# EAGLE design vest-ctrl (EAGLE 6.5.0)
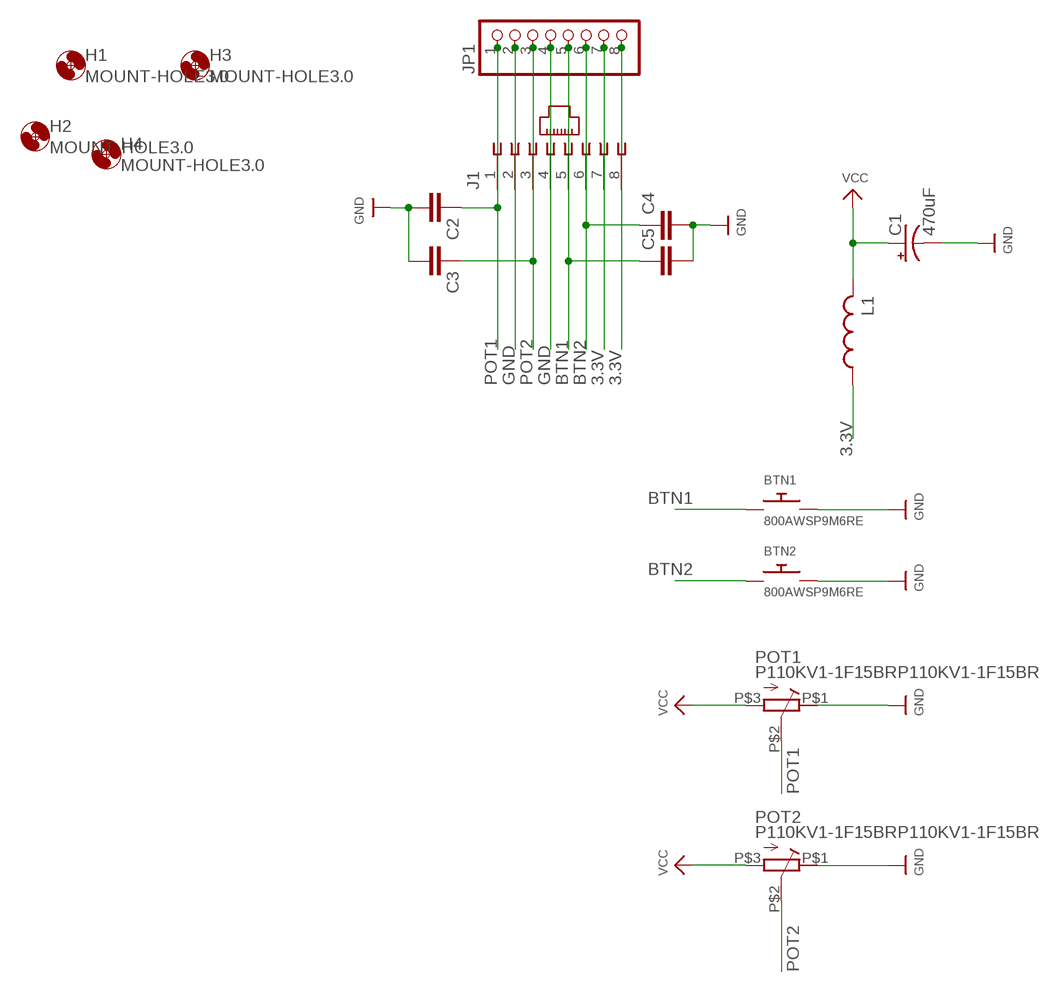
[diagram p0: schematic, sheet 1]

## Parts
BTN1  800AWSP9M6RE  [800AWSP9M6RE]
BTN2  800AWSP9M6RE  [800AWSP9M6RE]
C1  470uF  CPOL-USTT2D5L  [TT2D5L]
C2  C-EU025-025X050  [C025-025X050]
C3  C-EU025-025X050  [C025-025X050]
C4  C-EU025-025X050  [C025-025X050]
C5  C-EU025-025X050  [C025-025X050]
H1  MOUNT-HOLE3.0  [3,0]
H2  MOUNT-HOLE3.0  [3,0]
H3  MOUNT-HOLE3.0  [3,0]
H4  MOUNT-HOLE3.0  [3,0]
J1  215877-4  [215877-4]
JP1  HEADER-1X870MIL  [1X08_ROUND_70]
L1  L-US0207/10  [0207/10]
POT1  P110KV1-1F15BRP110KV1-1F15BR  [P110KV1-1F15BR]
POT2  P110KV1-1F15BRP110KV1-1F15BR  [P110KV1-1F15BR]

## Nets
3.3V: J1.7 J1.8 JP1.7 JP1.8 L1.1
BTN1: BTN1.SW1 C5.1 J1.5 JP1.5
BTN2: BTN2.SW1 C4.1 J1.6 JP1.6
GND: BTN1.SW2 BTN2.SW2 C1.- C2.2 C3.2 C4.2 C5.2 J1.2 J1.4 JP1.2 JP1.4 POT1.P$1(A) POT2.P$1(A)
POT1: C2.1 J1.1 JP1.1 POT1.P$2(S)
POT2: C3.1 J1.3 JP1.3 POT2.P$2(S)
VCC: C1.+ L1.2 POT1.P$3(E) POT2.P$3(E)

## Library data of the parts
BTN1 BTN2 = keves:800AWSP9M6RE
C1 = rcl:CPOL-US: POLARIZED CAPACITOR, American symbol
C2-C5 = rcl:C-EU: CAPACITOR, European symbol
H1-H4 = holes:MOUNT-HOLE: MOUNTING HOLE with drill center marker
J1 = con-amp:215877-4: AMP connector
JP1 = microbuilder:HEADER-1X8: PIN HEADER
L1 = rcl:L-US: INDUCTOR, American symbol
POT1 POT2 = keves:P110KV1-1F15BR

## Net classes
0 default: width 0.406 mm

## Board
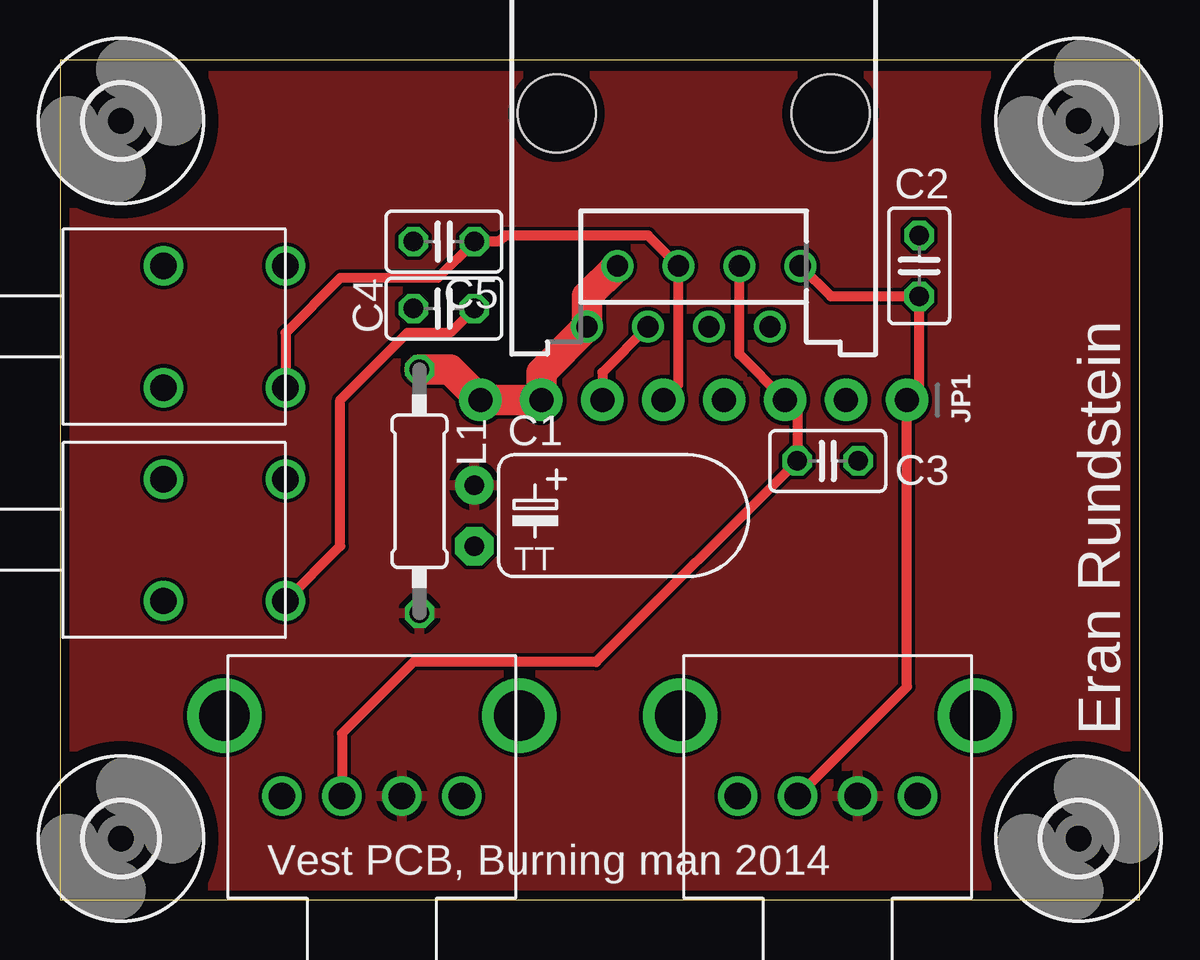
[diagram p1: board, top side]
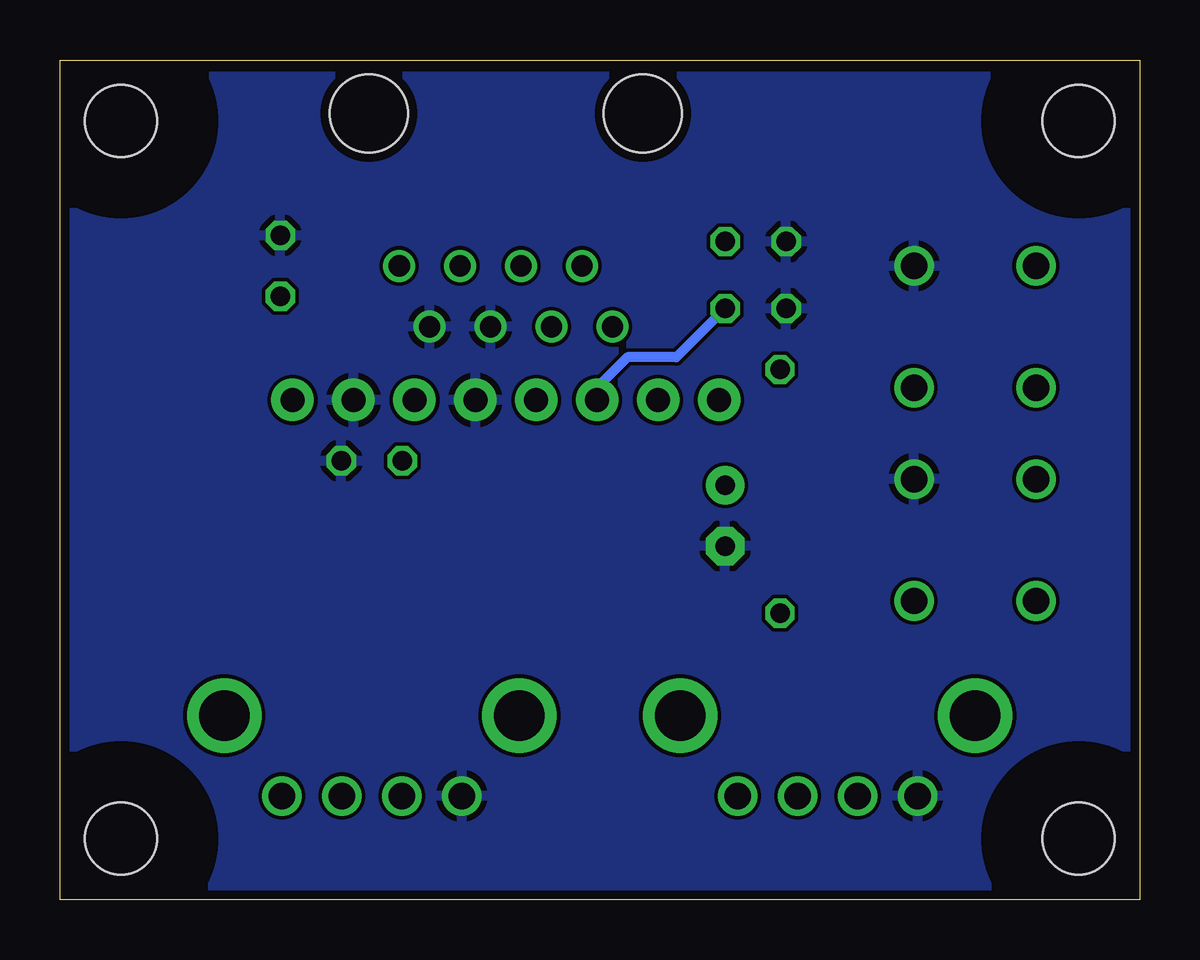
[diagram p2: board, bottom side, seen from below]

Size 45 x 35 mm. Coordinates in mm from the lower left corner, seen from the top.
Outline: 0,0 45,0 45,35 0,35 0,0
Copper layers (1*16): Top 0.0356mm / dielectric 1.5011mm / Bottom 0.0356mm
Design rules "oshpark_2layer": minimum track width 6mil, minimum drill 13mil, track to track 6mil, track to pad 6mil, pad to pad 6mil, via to via 6mil, smd to smd 6mil, copper to edge 15mil, drill to drill 6mil, minimum pad ring 7mil, minimum via ring 7mil, stop-mask expansion 3mil, vias tented up to drill 0mil, thermal gap 10mil

### Footprints (pad centres in the part's own frame; a part is rotated, then mirrored left to right if it is on the bottom)
800AWSP9M6RE = drill 1.1: P$2 -2.54,5.08; P$4 2.54,5.08; SW1 -2.54,0; SW2 2.54,0
TT2D5L = drill 0.813 pad 1.6: + -1.27,0 | drill 0.813 pad 1.6 octagon: - 1.27,0
C025-025X050 = drill 0.813 octagon: 1 -1.27,0; 2 1.27,0
3,0 = hole 3: 0,0
215877-4 = drill 0.889: 1 -4.445,6.35; 2 -3.175,8.89; 3 -1.905,6.35; 4 -0.635,8.89; 5 0.635,6.35; 6 1.905,8.89; 7 3.175,6.35; 8 4.445,8.89 | hole 3.251: -5.715,0; 5.715,0
1X08_ROUND_70 = drill 1 pad 1.778: 1 -8.89,0; 2 -6.35,0; 3 -3.81,0; 4 -1.27,0; 5 1.27,0; 6 3.81,0; 7 6.35,0; 8 8.89,0
0207/10 = drill 0.813 octagon: 1 -5.08,0; 2 5.08,0
P110KV1-1F15BR = drill 1.1: P$1 -3.75,0; P$2 -1.25,0; P$3 1.25,0; P$4 3.75,0 | drill 2.1: P$5 -6.15,3.35; P$6 6.15,3.35

### Placement (x,y rotation side)
BTN1  9.4,23.88 90 top
BTN2  9.4,14.99 90 top
C1  17.27,16 270 top
C2  35.81,26.42 90 top
C3  32,18.29 0 top
C4  16,24.64 180 top
C5  16,27.43 180 top
H1  2.54,2.54 0 top
H2  42.46,32.46 0 top
H3  2.54,32.46 0 top
H4  42.46,2.54 0 top
J1  26.42,32.77 180 top
JP1  26.42,20.83 180 top
L1  14.99,17.02 270 top
POT1  32,4.32 0 top
POT2  13,4.32 0 top

### Tracks (layer width: path | path; a pad name or v marks a point on that pad's centre or on a via)
3.3V
  Top 1.27: J1.7 21.97,25.15 J1.8 20.07,21.97 JP1.7 JP1.8 16.26,22.1 L1.1
BTN1
  Top 0.406: JP1.5 25.78,21.46 J1.5 24.51,27.69 18.54,27.69 18.29,27.43 C5.1 15.75,25.91 11.68,25.91 9.4,23.62 BTN1.SW1
BTN2
  Top 0.406: J1.6 22.61,21.97 JP1.6 | BTN2.SW1 11.68,14.73 11.68,20.83 14.48,23.62 16.26,23.62 C4.1
  Bottom 0.406: C4.1 19.3,22.61 21.34,22.61 22.61,21.34 JP1.6
GND
  pour Bottom: 0.25,0.25 44.96,0.25 44.96,34.32 0.25,34.32
POT1
  Top 0.406: J1.1 32.13,25.15 C2.1 35.81,21.34 JP1.1 35.31,8.87 POT1.P$2
POT2
  Top 0.406: J1.3 28.32,22.73 JP1.3 30.73,20.32 C3.1 22.35,9.91 14.73,9.91 11.75,6.92 POT2.P$2
VCC
  pour Top: 0.25,0.25 44.96,0.25 44.96,34.32 0.25,34.32

### Text on the board
tPlace: Eran Rundstein | Vest PCB, Burning man 2014